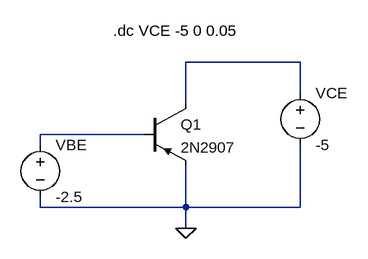
[diagram p0: schematic pnp_Ic.asc]
pnp_Ic.asc, the LTspice schematic file:
Version 4
SHEET 1 880 680
WIRE 432 -560 256 -560
WIRE 432 -512 432 -560
WIRE 256 -496 256 -560
WIRE 192 -448 32 -448
WIRE 32 -432 32 -448
WIRE 32 -336 32 -352
WIRE 256 -336 256 -400
WIRE 256 -336 32 -336
WIRE 432 -336 432 -432
WIRE 432 -336 256 -336
WIRE 256 -304 256 -336
FLAG 256 -304 0
SYMBOL voltage 432 -528 R0
WINDOW 123 0 0 Left 0
WINDOW 39 0 0 Left 0
SYMATTR InstName VCE
SYMATTR Value -5
SYMBOL voltage 32 -448 R0
WINDOW 123 0 0 Left 0
WINDOW 39 0 0 Left 0
SYMATTR InstName VBE
SYMATTR Value -2.5
SYMBOL pnp 192 -496 R0
SYMATTR InstName Q1
SYMATTR Value 2N2907
TEXT 144 -608 Left 2 !.dc VCE -5 0 0.05

The netlist it stands for:
* pnp_Ic.asc
VCE N001 0 -5
VBE N002 0 -2.5
Q1 N001 N002 0 0 2N2907
.model NPN NPN
.model PNP PNP
.lib standard.bjt
.dc VCE -5 0 0.05
.backanno
.end